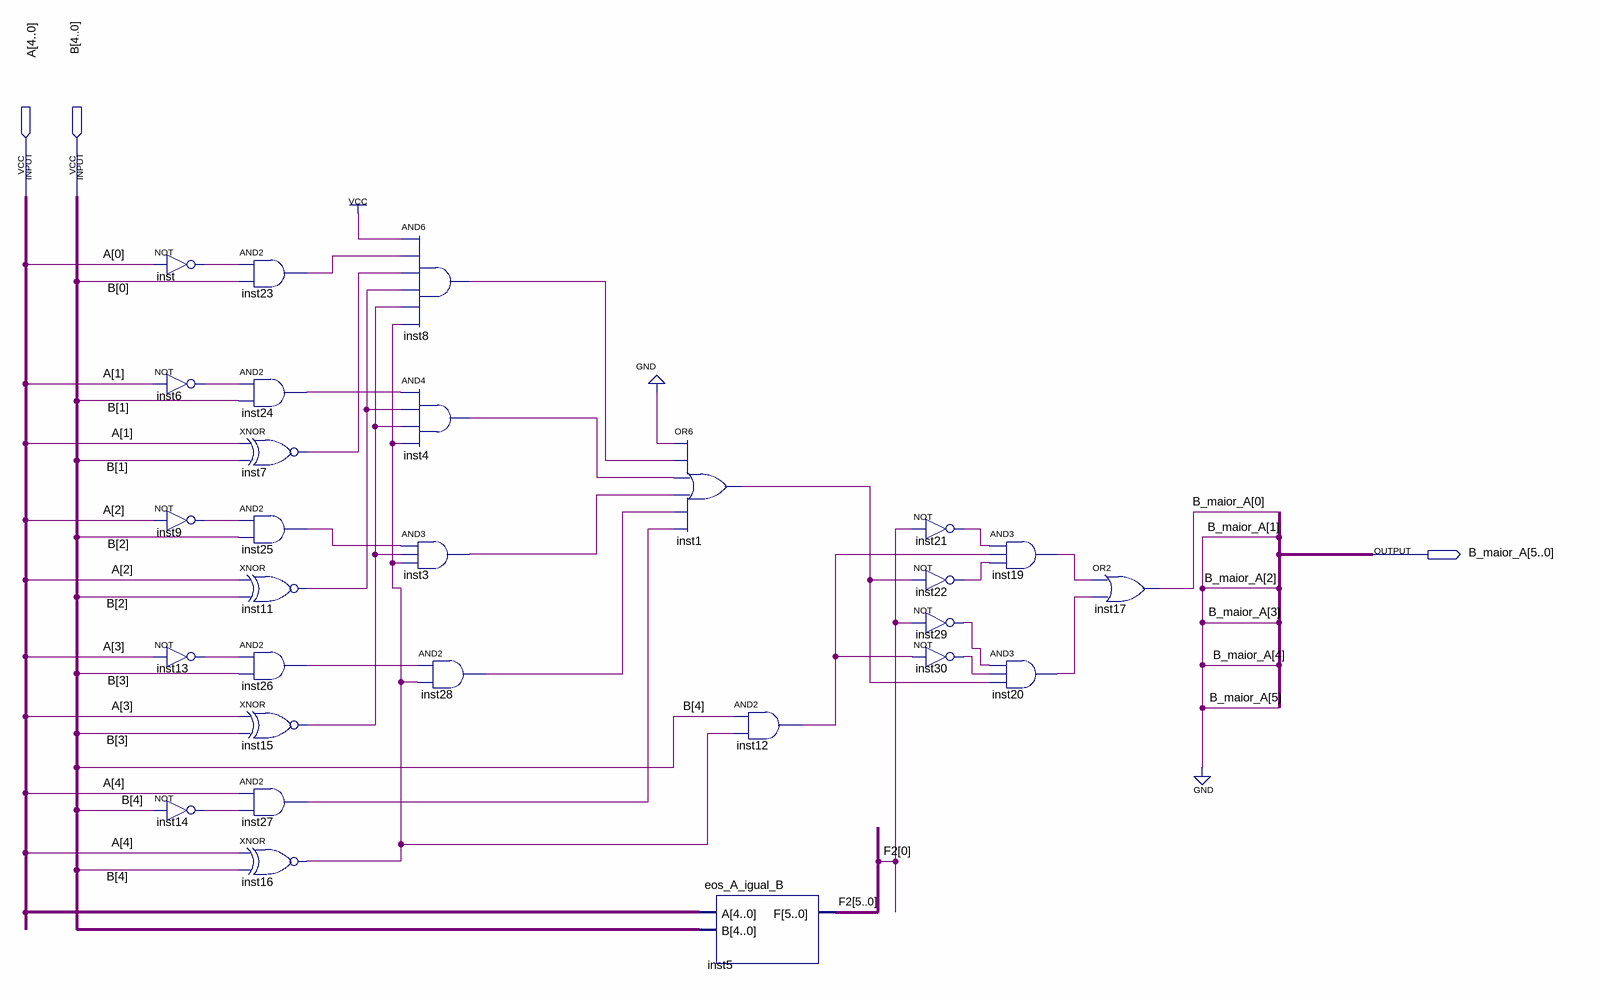
[diagram p0: schematic sheet]
// Quartus schematic mhrs_B_maior_A.bdf as structural Verilog: 28 symbols, 3 pins
module mhrs_B_maior_A (
  input  [4:0] A,
  input  [4:0] B,
  output [5:0] B_maior_A
);

  wire inst1_out, inst3_out, inst4_out, inst6_out, inst7_out, inst8_out, inst9_out, inst11_out, inst12_out,
       inst13_out, inst14_out, inst15_out, inst16_out, inst19_out, inst20_out, inst21_out, inst22_out,
       inst23_out, inst24_out, inst25_out, inst26_out, inst27_out, inst28_out, inst29_out, inst30_out,
       inst_out;
  wire [5:0] F2;

  not inst (inst_out, A[0]);
  not inst6 (inst6_out, A[1]);
  not inst9 (inst9_out, A[2]);
  not inst13 (inst13_out, A[3]);
  not inst14 (inst14_out, B[4]);
  and inst23 (inst23_out, inst_out, B[0]);
  and inst24 (inst24_out, inst6_out, B[1]);
  xnor inst7 (inst7_out, A[1], B[1]);
  and inst25 (inst25_out, inst9_out, B[2]);
  xnor inst11 (inst11_out, A[2], B[2]);
  and inst26 (inst26_out, inst13_out, B[3]);
  xnor inst15 (inst15_out, A[3], B[3]);
  and inst27 (inst27_out, A[4], inst14_out);
  xnor inst16 (inst16_out, A[4], B[4]);
  and inst8 (inst8_out, 1'b1, inst23_out, inst7_out, inst11_out, inst15_out, inst16_out);
  and inst4 (inst4_out, inst24_out, inst11_out, inst15_out, inst16_out);
  and inst3 (inst3_out, inst25_out, inst15_out, inst16_out);
  and inst28 (inst28_out, inst26_out, inst16_out);
  or inst1 (inst1_out, 1'b0, inst8_out, inst4_out, inst3_out, inst28_out, inst27_out);
  eos_A_igual_B inst5 (.A(A), .B(B), .F(F2));
  and inst12 (inst12_out, B[4], inst16_out);
  not inst21 (inst21_out, F2[0]);
  not inst22 (inst22_out, inst1_out);
  not inst29 (inst29_out, F2[0]);
  not inst30 (inst30_out, inst12_out);
  and inst19 (inst19_out, inst21_out, inst12_out, inst22_out);
  and inst20 (inst20_out, inst29_out, inst30_out, inst1_out);
  or inst17 (B_maior_A[0], inst19_out, inst20_out);

  assign B_maior_A[5:1] = {5{1'b0}};
endmodule
